# Altium project PowerLatchV3.PrjPcb
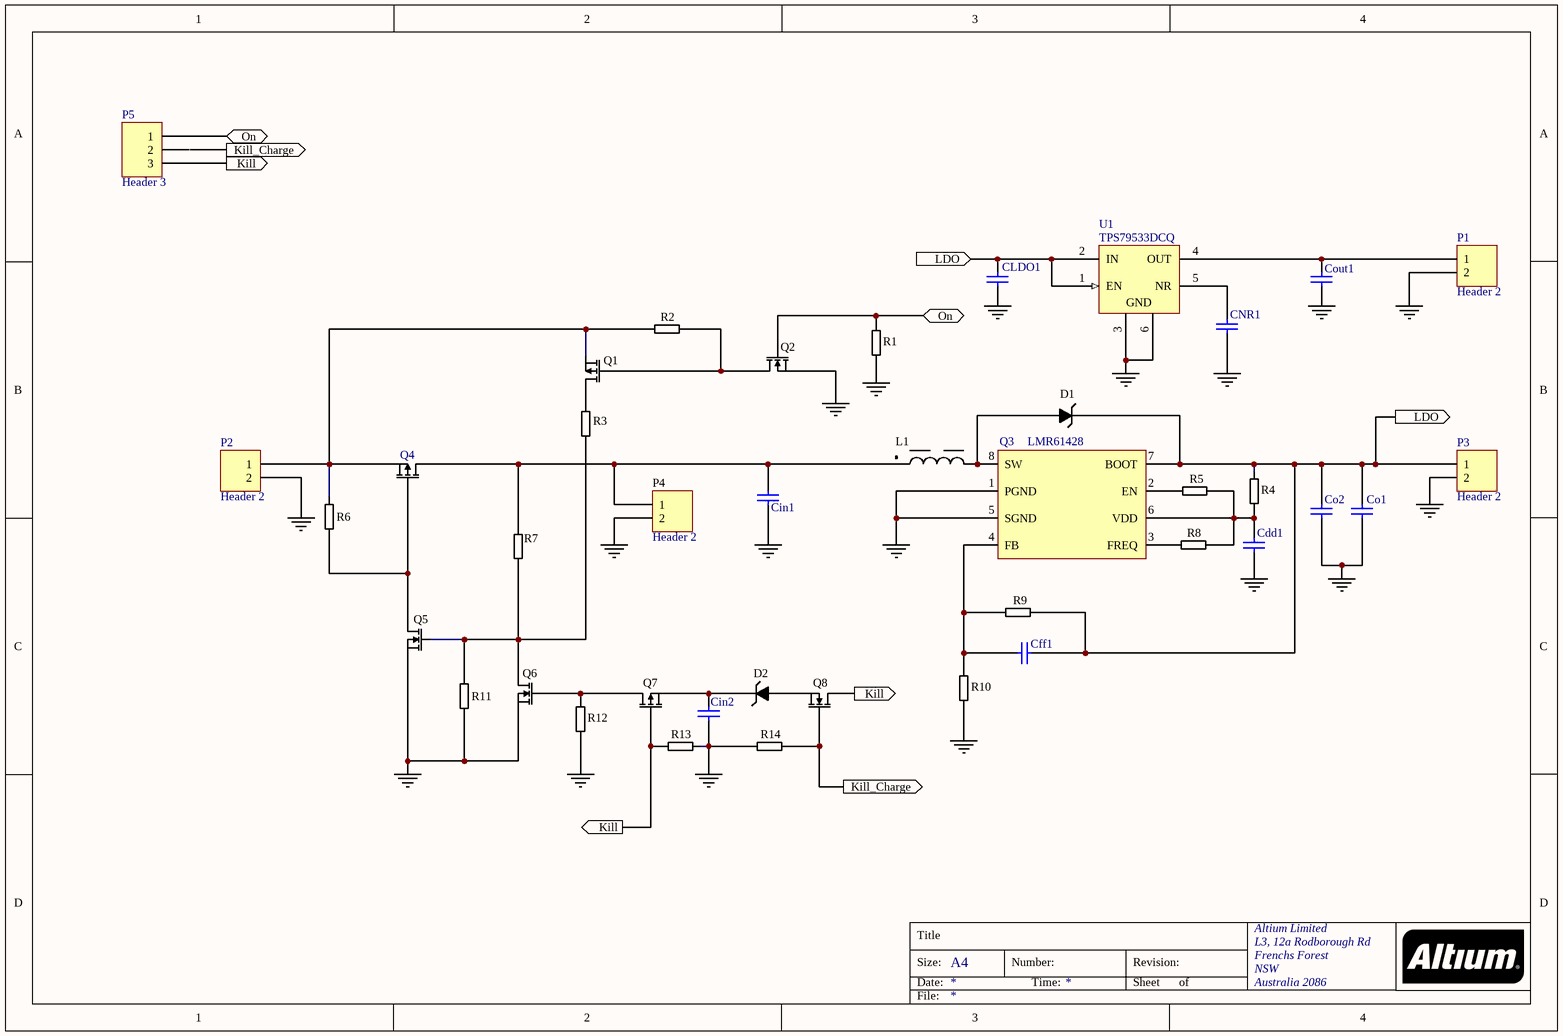
[diagram p0: PowerLatch.SchDoc]
1 sheet, 40 parts. Net scope: flat (ports and power ports of the same name join across sheets).

## Sheet PowerLatch.SchDoc
size A4; Organization: Altium Limited; Address1: L3, 12a Rodborough Rd; Address2: Frenchs Forest; Address3: NSW; Address4: Australia 2086

### Parts
Cdd1  Cap  [RESC1608X06N]  (value not drawn)
Cff1  Cap  [RESC1608X06N]  (value not drawn)
Cin1  Cap  [CAPMP7343X31N]  (value not drawn)
Cin2  Cap  [CAPMP7343X31N]  (value not drawn)
CLDO1  Cap  [RESC1608X06N]  (value not drawn)
CNR1  Cap  [RESC1608X06N]  (value not drawn)
Co1  Cap  [CAPC0805]  (value not drawn)
Co2  Cap  [CAP2812]  (value not drawn)
Cout1  Cap  [RESC1608X06N]  (value not drawn)
D1  Schottky  [DIOM4326X23N]  (value not drawn)
D2  Schottky  [DIOM4326X23N]  (value not drawn)
L1  Inductor  [INDP100100X51N]  (value not drawn)
P1  Header 2  [PCBComponent_1]
P2  Header 2  [PCBComponent_1]
P3  Header 2  [PCBComponent_1]
P4  Header 2  [PCBComponent_1]
P5  Header 3  [HDR1X3]
Q1  MOSFET P-Channel  [SOT95P245X110-3N]  (value not drawn)
Q2  MOSFET N-Channel  [SOT95P245X110-3N]  (value not drawn)
Q3  LMR61428  [TSOP65P490X110-8N]
Q4  MOSFET P-Channel  [SOT95P245X110-3N]  (value not drawn)
Q5  MOSFET N-Channel  [SOT95P245X110-3N]  (value not drawn)
Q6  MOSFET N-Channel  [SOT95P245X110-3N]  (value not drawn)
Q7  MOSFET P-Channel  [SOT95P245X110-3N]  (value not drawn)
Q8  MOSFET N-Channel  [SOT95P245X110-3N]  (value not drawn)
R1  Res?  (value not drawn)
R2  Res?  (value not drawn)
R3  Res?  (value not drawn)
R4  Res?  (value not drawn)
R5  Res?  (value not drawn)
R6  Res?  (value not drawn)
R7  Res?  (value not drawn)
R8  Res?  (value not drawn)
R9  Res?  (value not drawn)
R10  Res?  (value not drawn)
R11  Res?  (value not drawn)
R12  Res?  (value not drawn)
R13  Res?  (value not drawn)
R14  Res?  (value not drawn)
U1  TPS79533DCQ  [DCQ0006A_L]

### Ports
Kill (out), Kill_Charge (out), LDO (in), LDO (out), On (bidir)

### Nets
GND: Cdd1.1 Cin1.2 Cin2.2 CLDO1.1 CNR1.1 Co1.1 Co2.2 Cout1.1 P1.2 P2.2 P3.2 P4.2 Q2.2(S) Q3.1(PGND) Q3.5(SGND) Q5.2(S) Q6.2(S) R1.1 R10.1 R11.1 R12.1 R13.1 R14.2 U1.3(GND) U1.6(GND)
NetCdd1_2: Cdd1.2 Q3.6(VDD) R4.1 R5.1 R8.1
NetCff1_1: Cff1.1 CLDO1.2 Co1.2 Co2.1 D1.2(K) P3.1 Q3.7(BOOT) R4.2 R9.1 U1.1(EN) U1.2(IN) ; port LDO
NetCff1_2: Cff1.2 Q3.4(FB) R9.2 R10.2
NetCin1_1: Cin1.1 L1.1 P4.1 Q4.3(D) R7.2
NetCin2_1: Cin2.1 D2.2(K) Q7.2(S)
NetCNR1_2: CNR1.2 U1.5(NR)
NetCout1_2: Cout1.2 P1.1 U1.4(OUT)
NetD1_1: D1.1(A) L1.2 Q3.8(SW)
NetD2_1: D2.1(A) Q8.2(S)
NetP2_1: P2.1 Q1.2(S) Q4.2(S) R2.2 R6.2
NetP5_1: P5.1 Q2.1(G) R1.2 ; port On
NetP5_3: P5.3 Q7.1(G) Q8.3(D) R13.2 ; port Kill
NetQ1_1: Q1.1(G) Q2.3(D) R2.1
NetQ1_3: Q1.3(D) R3.2
NetQ3_2: Q3.2(EN) R5.2
NetQ3_3: Q3.3(FREQ) R8.2
NetQ4_1: Q4.1(G) Q5.3(D) R6.1
NetQ5_1: Q5.1(G) Q6.3(D) R3.1 R7.1 R11.2
NetQ6_1: Q6.1(G) Q7.3(D) R12.2
NetQ8_1: Q8.1(G) R14.1 ; port Kill_Charge

Not connected (* = marked no-connect by the designer): P5 2

### Notes on the sheet
- Title
- Size:
- Date:
- A4
- Number:
- Time:
- Revision:
- Sheet
- of
- File:

### Library data of the parts
Cdd1 CLDO1 Co1 Cout1 = Cap: Capacitor; Value: 1u; Published: 8-Jun-2000; LatestRevisionDate: 17-Jul-2002; LatestRevisionNote: Re-released for DXP Platform.; PackageReference: RAD-0.3; Publisher: Altium Limited; PackageDescription: Radial Cap, Thru-Hole; 2 Leads; 0.3 in Pin Spacing
Cff1 = Cap: Capacitor; Value: 39pF; Published: 8-Jun-2000; LatestRevisionDate: 17-Jul-2002; LatestRevisionNote: Re-released for DXP Platform.; PackageReference: RAD-0.3; Publisher: Altium Limited; PackageDescription: Radial Cap, Thru-Hole; 2 Leads; 0.3 in Pin Spacing
Cin1 Cin2 = Cap: Capacitor; Value: 22uF; Published: 8-Jun-2000; LatestRevisionDate: 17-Jul-2002; LatestRevisionNote: Re-released for DXP Platform.; PackageReference: RAD-0.3; Publisher: Altium Limited; PackageDescription: Radial Cap, Thru-Hole; 2 Leads; 0.3 in Pin Spacing
CNR1 = Cap: Capacitor; Value: 0.01u; Published: 8-Jun-2000; LatestRevisionDate: 17-Jul-2002; LatestRevisionNote: Re-released for DXP Platform.; PackageReference: RAD-0.3; Publisher: Altium Limited; PackageDescription: Radial Cap, Thru-Hole; 2 Leads; 0.3 in Pin Spacing
Co2 = Cap: Capacitor; Value: 68u; Published: 8-Jun-2000; LatestRevisionDate: 17-Jul-2002; LatestRevisionNote: Re-released for DXP Platform.; PackageReference: RAD-0.3; Publisher: Altium Limited; PackageDescription: Radial Cap, Thru-Hole; 2 Leads; 0.3 in Pin Spacing
P1-P4 = Header 2: Header, 2-Pin; LatestRevisionDate: 17-Jul-2002; LatestRevisionNote: Re-released for DXP Platform.; Publisher: Altium Limited
P5 = Header 3: Header, 3-Pin; LatestRevisionDate: 17-Jul-2002; LatestRevisionNote: Re-released for DXP Platform.; Publisher: Altium Limited
Q3 = LMR61428: Step-Up Voltage Regulator
R1-R14 = Res?: Value: 10k
U1 = CMP-0395-00363-2: Single Output High PSRR LDO, 500 mA, Fixed 3.3 V Output, 2.7 to 5.5 V Input, 6-pin SOT-223 (DCQ), Green (RoHS & no Sb/Br); Manufacturer: Texas Instruments; Fixed Output Options(V): 3.3; Vin(Max)(V): 5.5; Rating: Catalog; Vin(Min)(V): 2.7; Iq(Typ)(mA): 0.26; Accuracy(%): 2; Vdo(Typ)(mV): 105; Iout(Max)(A): 0.5; SubFamily: Single Channel LDO; Eco-Plan: Green (RoHS & no Sb/Br); ComponentLink2Description: Datasheet; ComponentLink3Description: Package Specification; ComponentLink2URL: http://www.ti.com/general/docs/lit/getliterature.tsp?genericPartNumber=TPS79533&fileType=pdf; PackageVersion: 4202109/D; PackageReference: DCQ0006A; Vout Adj(Max)(V): 3.3; Vout Adj(Min)(V): 3.3; PartNumber: TPS79533DCQ; PackageDescription: 6-Pin Plastic Small Outline, Body 3.5 x 6.5 mm, Pitch 1.27 mm; ComponentLink1Description: Manufacturer URL; DatasheetVersion: SLVS350H; Mounting Technology: Surface Mount; ComponentLink1URL: http://www.ti.com/; ComponentLink3URL: http://www.ti.com/litv/pdf/mpds098c